# EAGLE design SWG_1_1 (EAGLE 8.3.2)
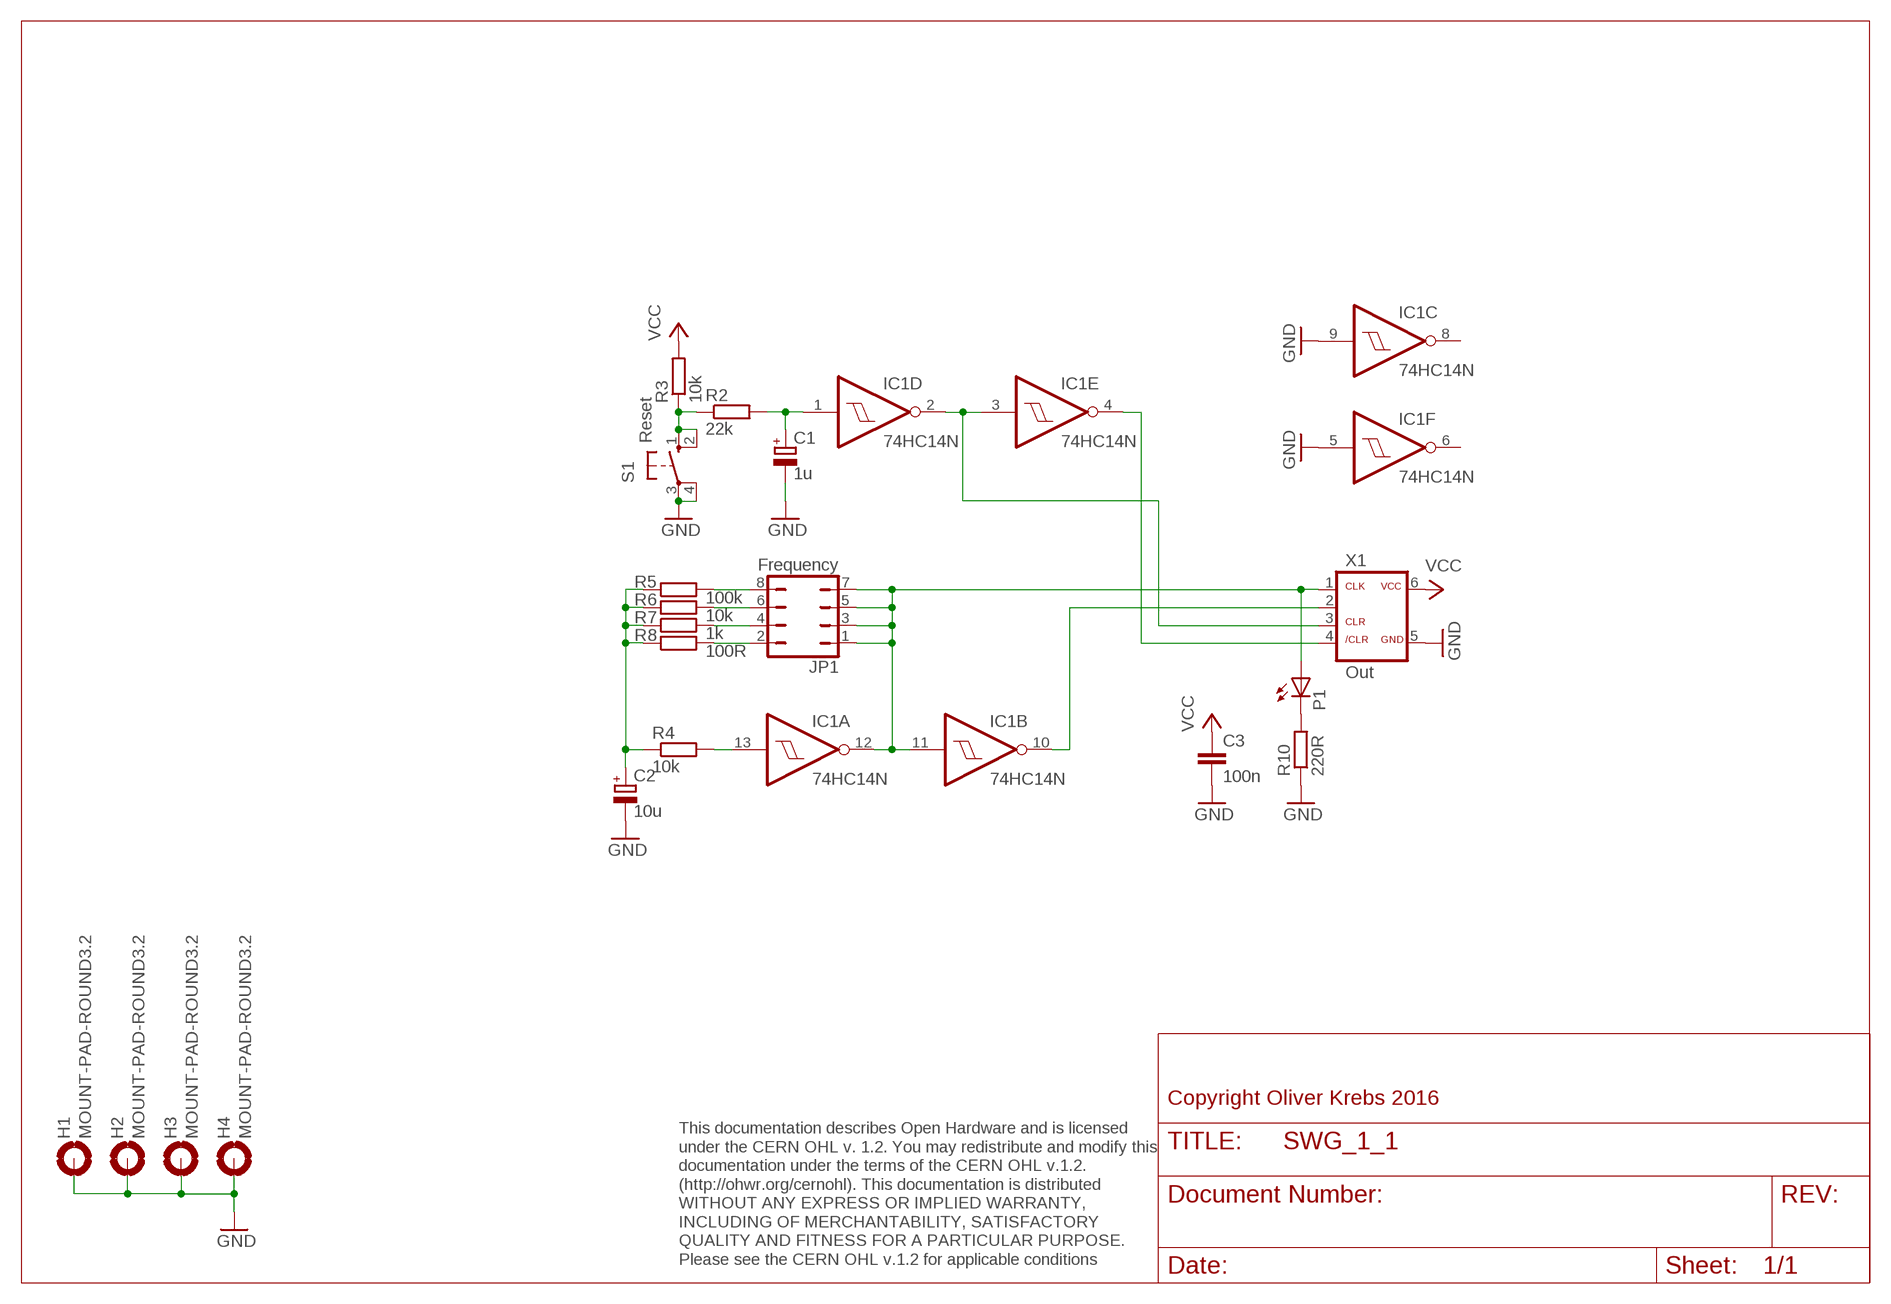
[diagram p0: schematic, sheet 1]

## Parts
C1  1u  CPOL-EUE2-5  [E2-5]
C2  10u  CPOL-EUE2-5  [E2-5]
C3  100n  C-EU050-025X075  [C050-025X075]
H1  MOUNT-PAD-ROUND3.2  [3,2-PAD]
H2  MOUNT-PAD-ROUND3.2  [3,2-PAD]
H3  MOUNT-PAD-ROUND3.2  [3,2-PAD]
H4  MOUNT-PAD-ROUND3.2  [3,2-PAD]
IC1  74HC14N  [DIL14]
JP1  Frequency  JP4Q  [JP4Q]
P1  LED3MM  [LED3MM]
R2  22k  R-EU_0207/10  [0207/10]
R3  10k  R-EU_0207/10  [0207/10]
R4  10k  R-EU_0207/10  [0207/10]
R5  100k  R-EU_0207/10  [0207/10]
R6  10k  R-EU_0207/10  [0207/10]
R7  1k  R-EU_0207/10  [0207/10]
R8  100R  R-EU_0207/10  [0207/10]
R10  220R  R-EU_0207/10  [0207/10]
S1  Reset  10-XX  [B3F-10XX]
X1  Out  ML6C  [ML-6]

## Nets
GND: C1.- C2.- C3.2 H1.B3,2(MOUNT) H2.B3,2(MOUNT) H3.B3,2(MOUNT) H4.B3,2(MOUNT) IC1.5(F:I) IC1.9(C:I) R10.1 S1.3(P) S1.4(P1) X1.5
N$1: P1.K(C) R10.2
N$2: IC1.4(E:O) X1.4
N$3: IC1.2(D:O) IC1.3(E:I) X1.3
N$7: IC1.11(B:I) IC1.12(A:O) JP1.1 JP1.3 JP1.5 JP1.7 P1.A X1.1
N$8: JP1.8 R5.2
N$9: JP1.6 R6.2
N$10: JP1.4 R7.2
N$11: JP1.2 R8.2
N$12: IC1.13(A:I) R4.2
N$13: C2.+ R4.1 R5.1 R6.1 R7.1 R8.1
N$14: IC1.10(B:O) X1.2
N$17: R2.1 R3.1 S1.1(S) S1.2(S1)
N$20: C1.+ IC1.1(D:I) R2.2
VCC: C3.1 R3.2 X1.6
Unconnected: IC1.6(F:O) IC1.8(C:O)

## Notes on the sheet
- Copyright Oliver Krebs 2016
- This documentation describes Open Hardware and is licensed 
  under the CERN OHL v. 1.2. You may redistribute and modify this 
  documentation under the terms of the CERN OHL v.1.2. 
  (http://ohwr.org/cernohl). This documentation is distributed
  WITHOUT ANY EXPRESS OR IMPLIED WARRANTY, 
  INCLUDING OF MERCHANTABILITY, SATISFACTORY 
  QUALITY AND FITNESS FOR A PARTICULAR PURPOSE. 
  Please see the CERN OHL v.1.2 for applicable conditions

## Power pins joined to a net without a drawn wire
GND: IC1.7(P:GND)
VCC: IC1.14(P:VCC)

## Library data of the parts
C1 C2 = resistor:CPOL-EU: POLARIZED CAPACITOR, European symbol
C3 = 01-my_rcl:C-EU: CAPACITOR, European symbol
H1-H4 = holes:MOUNT-PAD-ROUND: MOUNTING PAD, round
IC1 = 74xx-eu:74*14: Hex schmitt trigger INVERTER
JP1 = 01-my-con:JP4Q
P1 = 01-my-led:LED: LED OSRAM: - CHIPLED LG R971, LG N971, LY N971, LG Q971, LY Q971, LO R971, LY R971 LH N974, LH R974 LS Q976, LO Q976, LY Q976 LO Q996 - Hyper CHIPLED LW Q18S LB Q993, LB Q99A, LB R99A - SideLED LS A670, LO A670, LY A670, LG A670, LP A670 LB A673, LV A673, LT A673, LW A673 LH A674 LY A675 LS A676, LA A676, LO A676, LY A676, LW A676 LS A679, LY A679, LG A679 - Hyper Micro SIDELED® LS Y876, LA Y876, LO Y876, LY Y876 LT Y87S - SmartLED LW L88C, LW L88S LB L89C, LB L89S, LG L890 LS L89K, LO L89K, LY L89K LS L896, LA L896, LO L896, LY L896 - TOPLED LS T670, LO T670, LY T670, LG T670, LP T670 LSG T670, LSP T670, LSY T670, LOP T670, LYG T670 LG T671, LOG T671, LSG T671 LB T673, LV T673, LT T673, LW T673 LH T674 LS T676, LA T676, LO T676, LY T676, LB T676, LH T676, LSB T676, LW T676 LB T67C, LV T67C, LT T67C, LS T67K, LO T67K, LY T67K, LW E67C LS E67B, LA E67B, LO E67B, LY E67B, LB E67C, LV E67C, LT E67C LW T67C LS T679, LY T679, LG T679 LS T770, LO T770, LY T770, LG T770, LP T770 LB T773, LV T773, LT T773, LW T773 LH T774 LS E675, LA E675, LY E675, LS T675 LS T776, LA T776, LO T776, LY T776, LB T776 LHGB T686 LT T68C, LB T68C - Hyper Mini TOPLED® LB M676 - Mini TOPLED Santana® LG M470 LS M47K, LO M47K, LY M47K Source: http://www.osram.convergy.de LUXEON: - LUMILED® LXK2-PW12-R00, LXK2-PW12-S00, LXK2-PW14-U00, LXK2-PW14-V00 LXK2-PM12-R00, LXK2-PM12-S00, LXK2-PM14-U00 LXK2-PE12-Q00, LXK2-PE12-R00, LXK2-PE12-S00, LXK2-PE14-T00, LXK2-PE14-U00 LXK2-PB12-K00, LXK2-PB12-L00, LXK2-PB12-M00, LXK2-PB14-N00, LXK2-PB14-P00, LXK2-PB14-Q00 LXK2-PR12-L00, LXK2-PR12-M00, LXK2-PR14-Q00, LXK2-PR14-R00 LXK2-PD12-Q00, LXK2-PD12-R00, LXK2-PD12-S00 LXK2-PH12-R00, LXK2-PH12-S00 LXK2-PL12-P00, LXK2-PL12-Q00, LXK2-PL12-R00 Source: www.luxeon.com KINGBRIGHT: KA-3528ASYC Source: www.kingbright.com
R2-R8 R10 = 01-my_rcl:R-EU_: RESISTOR, European symbol
S1 = switch-omron:10-XX: OMRON SWITCH; MPN: B3F-1000; OC_FARNELL: 176432; OC_NEWARK: 36M3542
X1 = 01-my-con:ML6C

## Board
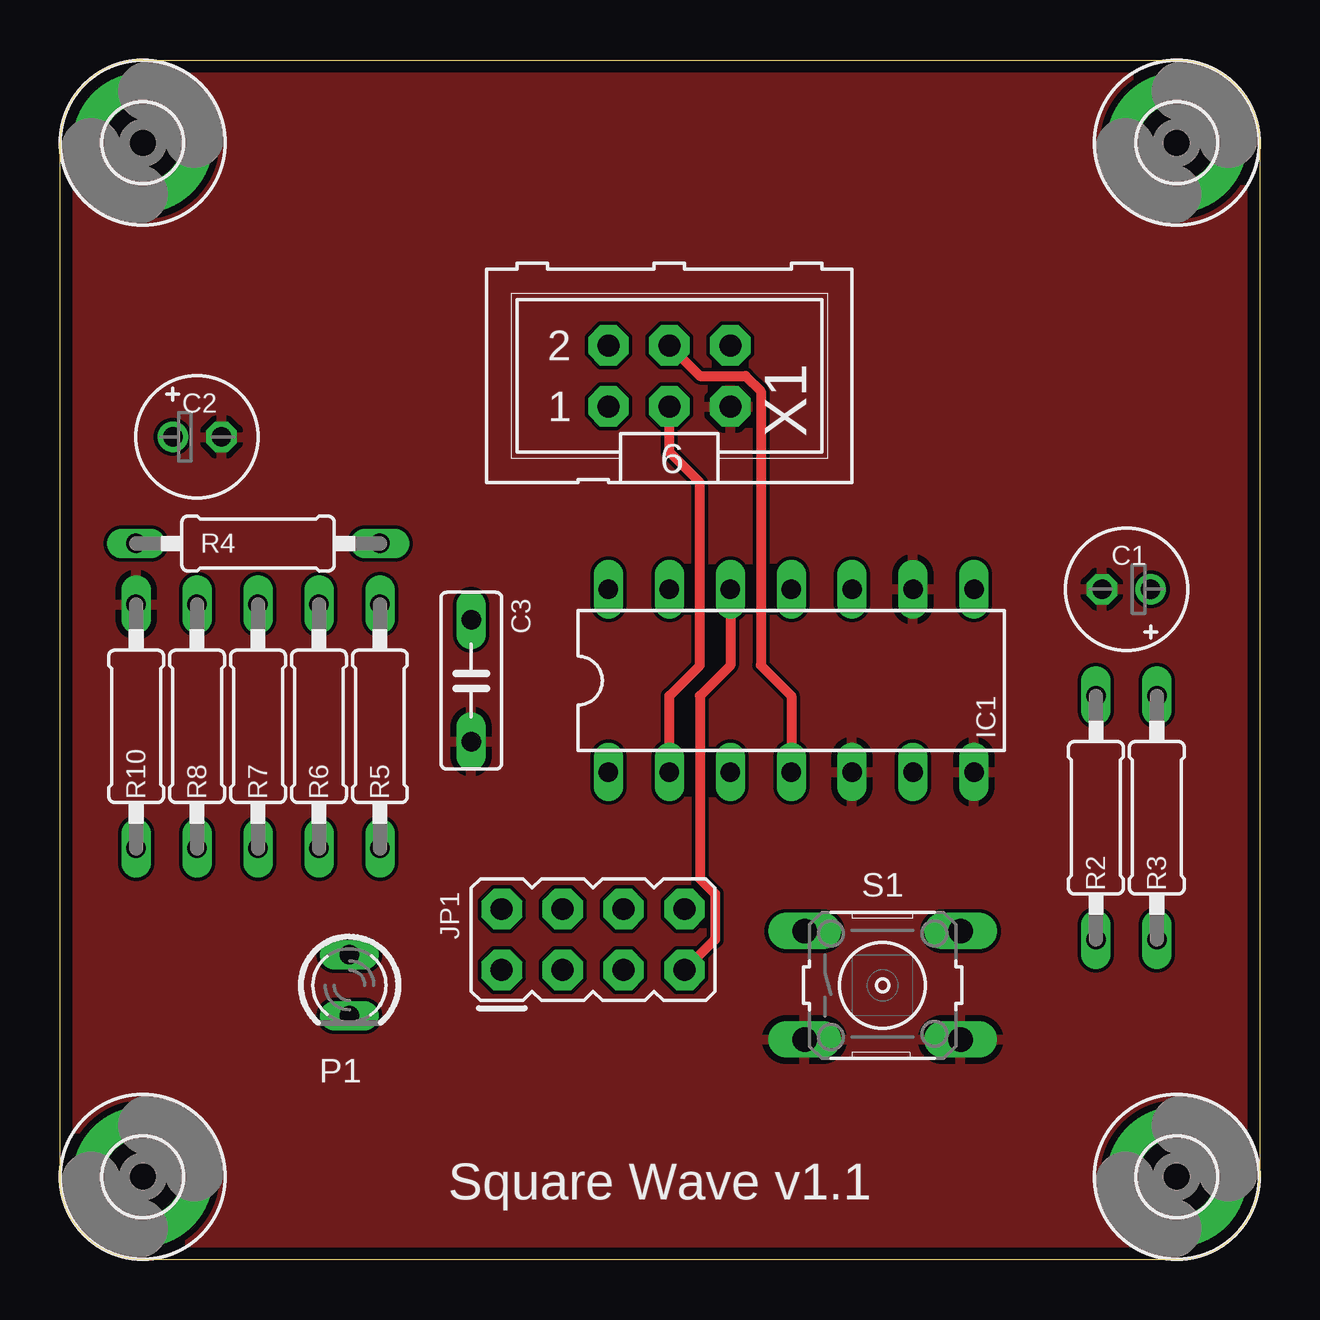
[diagram p1: board, top side]
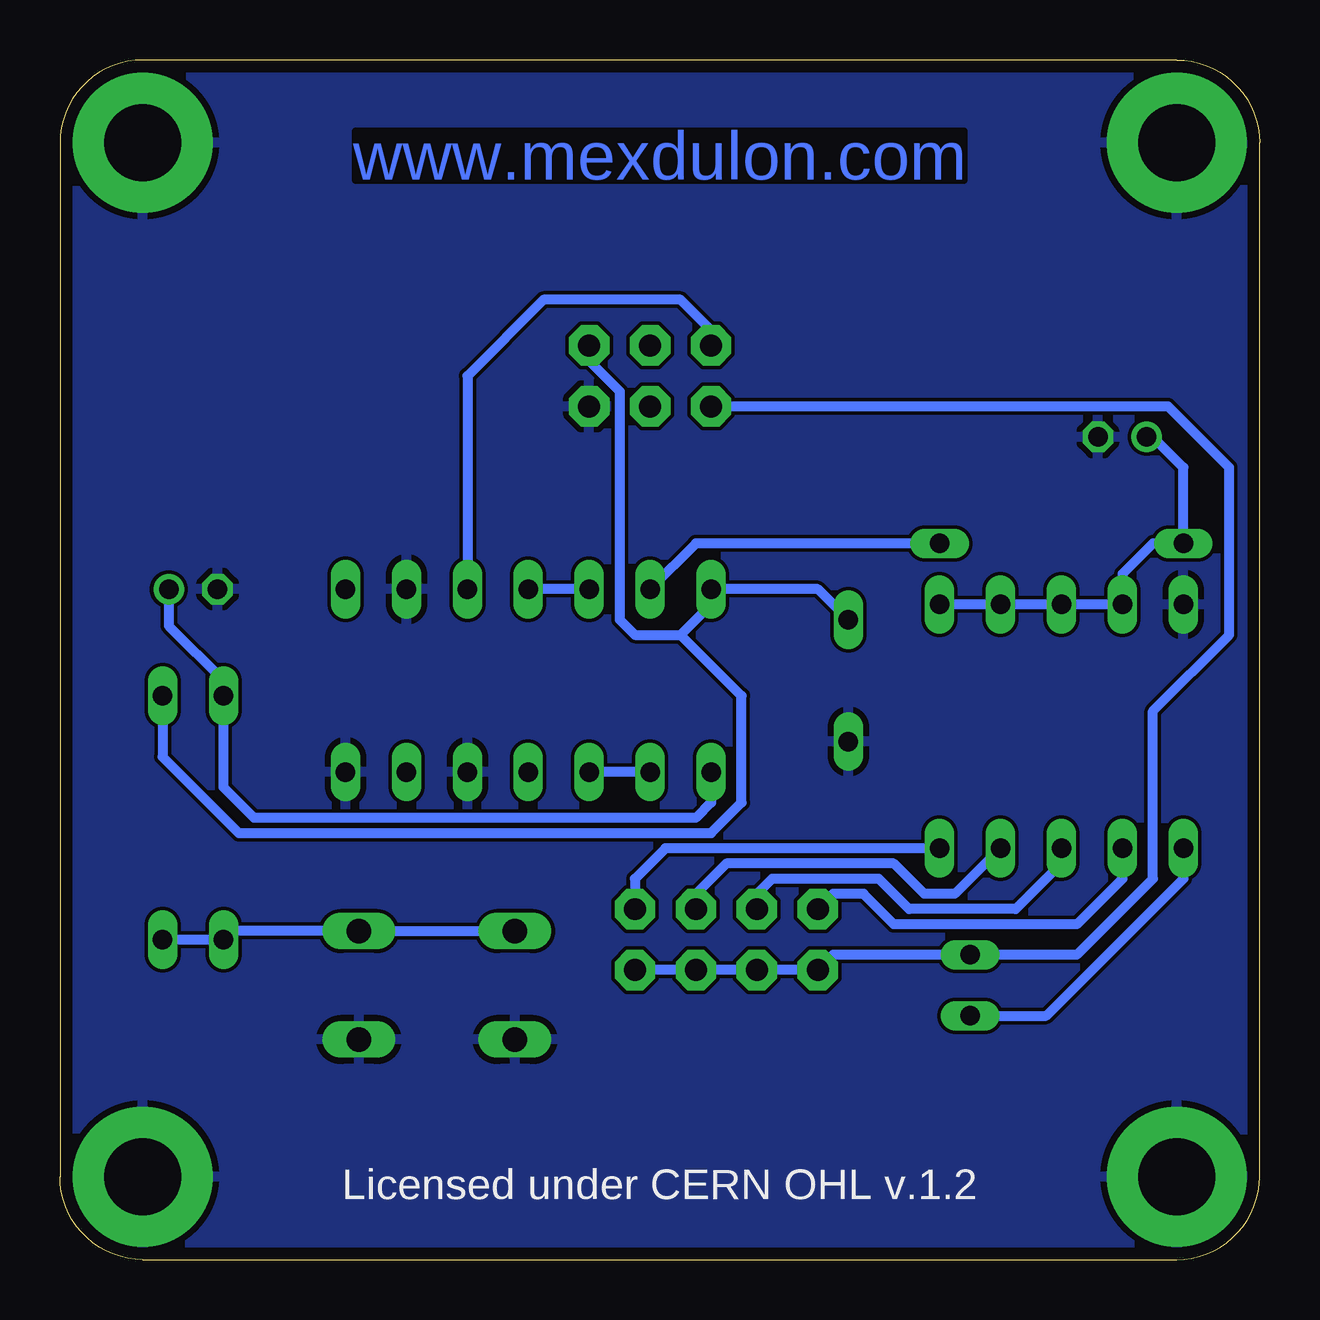
[diagram p2: board, bottom side, seen from below]

Size 50 x 50 mm. Coordinates in mm from the lower left corner, seen from the top.
Outline: 0,3.45 0,46.55 arc-90 3.45,50 46.55,50 arc-90 50,46.55 50,3.45 arc-90 46.55,0 3.45,0 arc-90 0,3.45
Copper layers (1*16): Top 0.035mm / dielectric 1.6mm / Bottom 0.035mm
Design rules "Elecrow_2-layer_PCB_eagle_rule": minimum track width 6mil, minimum drill 12mil, track to track 6mil, track to pad 6mil, pad to pad 6mil, via to via 8mil, smd to smd 0mil, copper to edge 20mil, drill to drill 10mil, minimum pad ring 6mil, minimum via ring 6mil, stop-mask expansion 0mil, vias tented up to drill 100mil, thermal gap 10mil

### Footprints (pad centres in the part's own frame; a part is rotated, then mirrored left to right if it is on the bottom)
E2-5 = drill 0.813 pad 1.27: + -1.016,0 | drill 0.813 pad 1.27 octagon: - 1.016,0
C050-025X075 = drill 0.813 long: 1 -2.54,0; 2 2.54,0
3,2-PAD = drill 3.2 pad 5.842: B3,2 0,0
DIL14 = drill 0.813 long: 1 -7.62,-3.81; 2 -5.08,-3.81; 3 -2.54,-3.81; 4 0,-3.81; 5 2.54,-3.81; 6 5.08,-3.81; 7 7.62,-3.81; 8 7.62,3.81; 9 5.08,3.81; 10 2.54,3.81; 11 0,3.81; 12 -2.54,3.81; 13 -5.08,3.81; 14 -7.62,3.81
JP4Q = drill 0.914 pad 1.676 octagon: 1 -3.81,-1.27; 2 -3.81,1.27; 3 -1.27,-1.27; 4 -1.27,1.27; 5 1.27,-1.27; 6 1.27,1.27; 7 3.81,-1.27; 8 3.81,1.27
LED3MM = drill 0.813 long: A -1.27,0; K 1.27,0
0207/10 = drill 0.813 long: 1 -5.08,0; 2 5.08,0
B3F-10XX = drill 1.016 long: 1 -3.251,2.261; 2 3.251,2.261; 3 -3.251,-2.261; 4 3.251,-2.261
ML-6 = drill 0.914 pad 1.676 octagon: 1 -2.54,-1.27; 2 -2.54,1.27; 3 0,-1.27; 4 0,1.27; 5 2.54,-1.27; 6 2.54,1.27

### Placement (x,y rotation side)
C1  44.45,27.94 180 top
C2  5.71,34.29 0 top
C3  17.14,24.13 270 top
H1  3.45,3.45 0 top
H2  3.45,46.55 0 top
H3  46.55,3.45 0 top
H4  46.55,46.55 0 top
IC1  30.48,24.13 0 top
JP1  22.23,13.34 0 top
P1  12.06,11.43 270 top
R2  43.18,18.41 90 top
R3  45.72,18.41 90 top
R4  8.26,29.84 0 top
R5  13.34,22.23 270 top
R6  10.79,22.23 270 top
R7  8.26,22.23 270 top
R8  5.71,22.23 270 top
R10  3.17,22.23 270 top
S1  34.29,11.43 0 top
X1  25.4,36.83 0 top

### Tracks (layer width: path | path; a pad name or v marks a point on that pad's centre or on a via)
GND
  pour Bottom: -0.17,0 -0.17,50.16 50,50.16 50,0
  pour Top: -0.17,0 -0.17,50.16 50,50.16 50,0
N$1
  Bottom 0.406: P1.K 8.89,10.16 3.17,15.88 R10.2
N$2
  Top 0.406: X1.4 26.67,36.83 28.57,36.83 29.21,36.2 29.21,24.77 30.48,23.5 IC1.4
N$3
  Top 0.406: IC1.2 25.4,23.5 26.67,24.77 26.67,32.38 25.4,33.66 X1.3
  Bottom 0.406: IC1.2 IC1.3
N$7
  Top 0.406: IC1.12 27.94,24.77 26.67,23.5 26.67,15.88 27.3,15.24 27.3,13.34 JP1.7
  Bottom 0.406: JP1.7 JP1.5 JP1.3 JP1.1 17.78,12.7 P1.A 7.62,12.7 4.45,15.88 4.45,22.86 1.27,26.04 1.27,33.02 3.81,35.56 X1.1 | IC1.12 IC1.11
N$8
  Bottom 0.406: R5.2 24.77,17.14 26.04,15.88 JP1.8
N$9
  Bottom 0.406: R6.2 12.7,15.24 13.97,15.24 15.24,16.51 22.23,16.51 23.5,15.24 JP1.6
N$10
  Bottom 0.406: R7.2 8.26,16.51 10.16,14.61 14.61,14.61 15.88,15.88 20.32,15.88 20.95,15.24 JP1.4
N$11
  Bottom 0.406: R8.2 5.71,15.88 7.62,13.97 15.24,13.97 16.51,15.24 17.78,15.24 JP1.2
N$12
  Bottom 0.406: R4.2 23.5,29.84 IC1.13
N$13
  Bottom 0.406: R5.1 R6.1 R7.1 R8.1 5.71,28.57 4.45,29.84 R4.1 3.17,33.02 4.45,34.29 C2.+
N$14
  Bottom 0.406: IC1.10 33.02,36.83 29.84,40.01 24.13,40.01 22.86,38.73 X1.2
N$17
  Bottom 0.406: R3.1 R2.1 42.82,13.69 S1.2 S1.1
N$20
  Bottom 0.406: C1.+ 45.47,26.42 43.18,24.13 R2.2 43.18,19.68 41.91,18.41 23.5,18.41 22.86,19.05 IC1.1
VCC
  Bottom 0.406: C3.1 18.41,27.94 IC1.14 22.86,27.3 24.13,26.04 | 24.13,26.04 26.04,26.04 26.67,26.67 26.67,36.2 27.94,37.47 X1.6 | R3.2 45.72,20.95 42.55,17.78 22.86,17.78 21.59,19.05 21.59,23.5 24.13,26.04

### Text on the board
Bottom: www.mexdulon.com
tNames: Square Wave v1.1
bNames: Licensed under CERN OHL v.1.2
tValues: 1000 Hz | 100 Hz | 10 Hz | 1 Hz